# EAGLE design Pure Keys aec-pcb1 (EAGLE 8.6.0)

## Sheet 1 of 7: ATMEGA328P
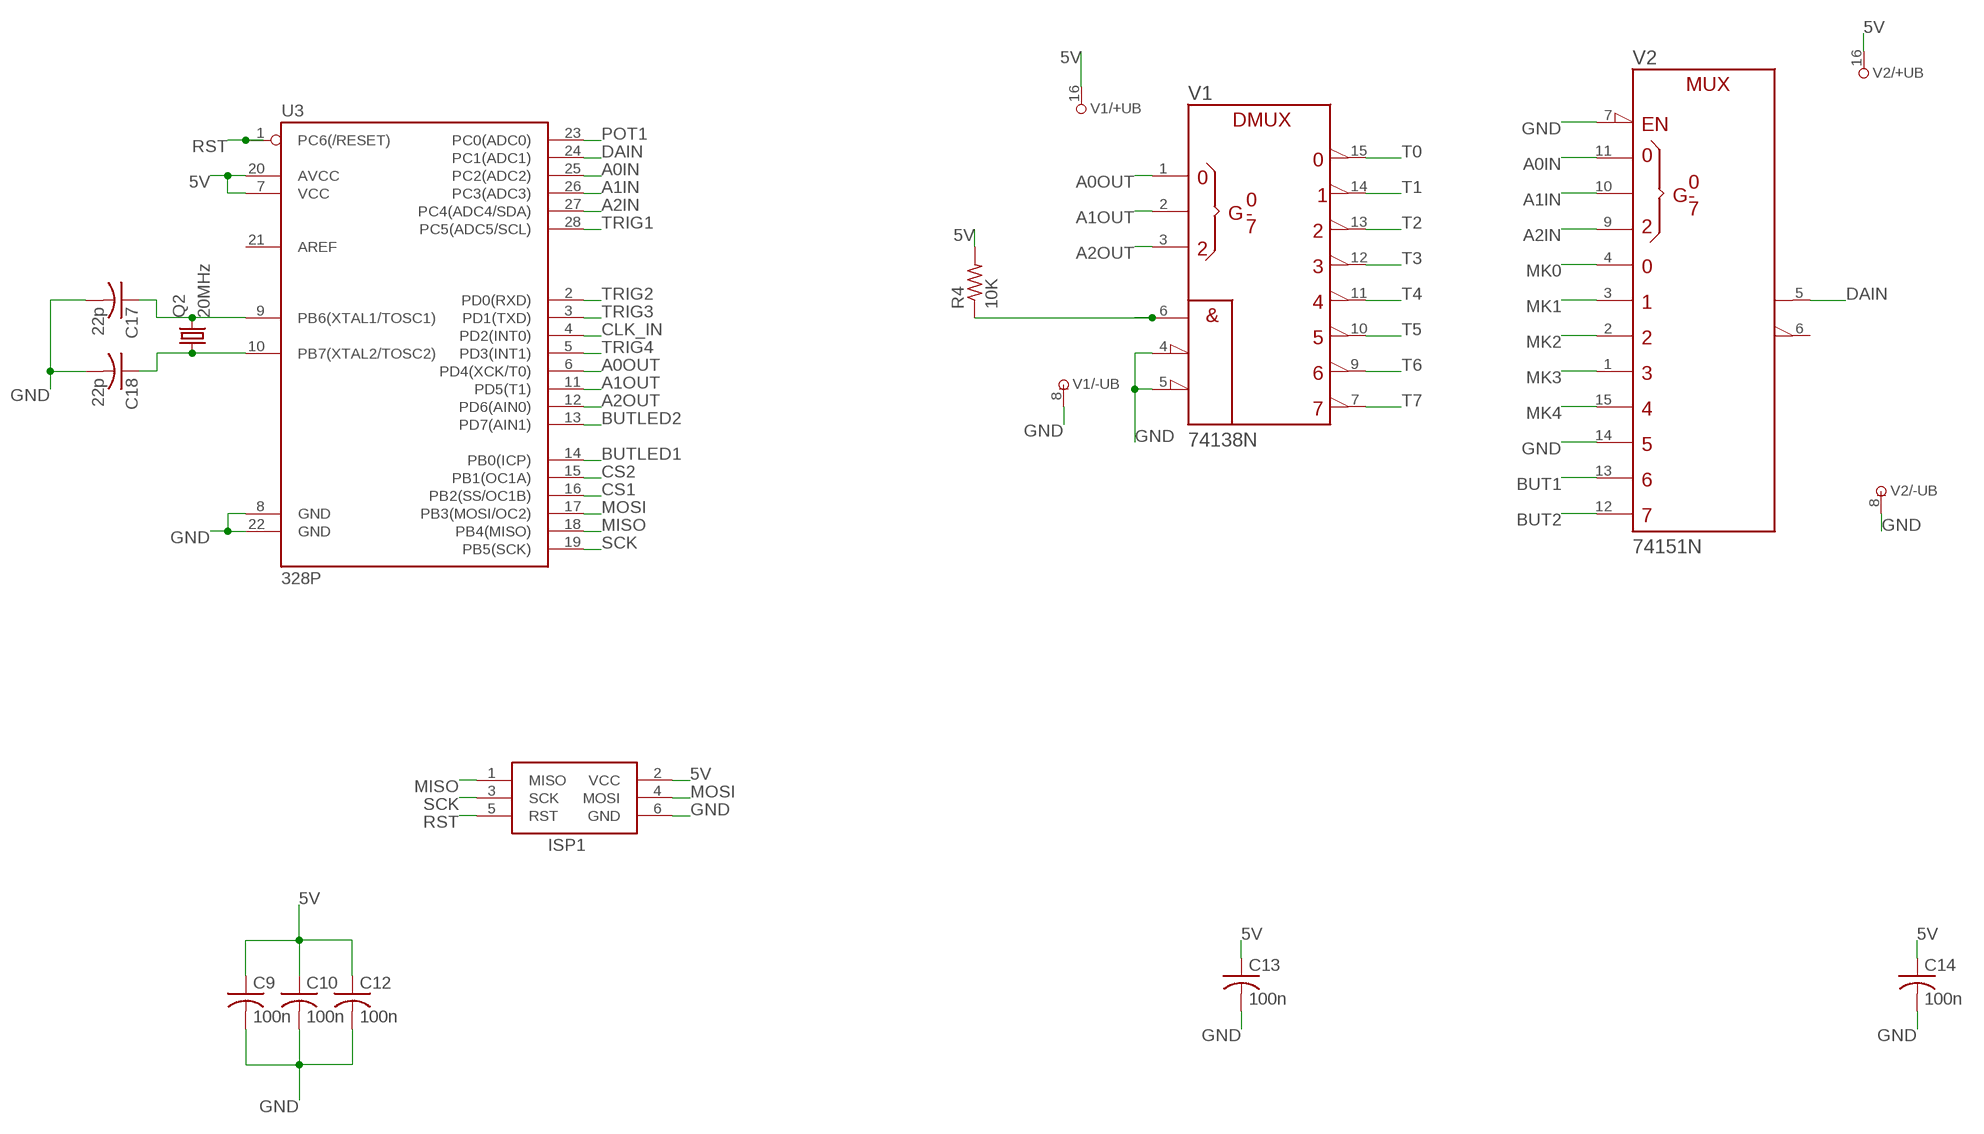
[diagram p0: schematic, sheet 1]

### Parts
C9  100n  C-USC0805K  [C0805K]
C10  100n  C-USC0805K  [C0805K]
C12  100n  C-USC0805K  [C0805K]
C13  100n  C-USC0805K  [C0805K]
C14  100n  C-USC0805K  [C0805K]
C17  22p  C-USC0805K  [C0805K]
C18  22p  C-USC0805K  [C0805K]
ISP1  AVRISP-6  [AVRISP]
Q2  20MHz  CRYSTALHC49UP  [HC49UP]
R4  10K  R-US_R0805  [R0805]
U3  328P  ATMEGA328P_PDIP  [DIP28]
V1  74138N  [DIL16]
V2  74151N  [DIL16]

### Nets
5V: C9.1 C10.1 C12.1 C13.1 C14.1 ISP1.2(VCC) R4.2 U3.7(VCC) U3.20(AVCC) V1.16(+UB) V2.16(+UB) ; also sheet 2,4,5,6,7
A0IN: U3.25(PC2(ADC2)) V2.11(A)
A0OUT: U3.6(PD4(XCK/T0)) V1.1(A)
A1IN: U3.26(PC3(ADC3)) V2.10(B)
A1OUT: U3.11(PD5(T1)) V1.2(B)
A2IN: U3.27(PC4(ADC4/SDA)) V2.9(C)
A2OUT: U3.12(PD6(AIN0)) V1.3(C)
BUT1: V2.13(D6) ; also sheet 6
BUT2: V2.12(D7) ; also sheet 6
BUTLED1: U3.14(PB0(ICP)) ; also sheet 6
BUTLED2: U3.13(PD7(AIN1)) ; also sheet 6
CLK_IN: U3.4(PD2(INT0)) ; also sheet 7
CS1: U3.16(PB2(SS/OC1B)) ; also sheet 5
CS2: U3.15(PB1(OC1A)) ; also sheet 5
DAIN: U3.24(PC1(ADC1)) V2.5(Y)
ENOUT: R4.1 V1.6(G1)
GND: C9.2 C10.2 C12.2 C13.2 C14.2 C17.2 C18.2 ISP1.6(GND) U3.8(GND) U3.22(GND) V1.4(!G2A) V1.5(!G2B) V1.8(-UB) V2.7(!G) V2.8(-UB) V2.14(D5) ; also sheet 2,3,4,5,6,7
MISO: ISP1.1(MISO) U3.18(PB4(MISO))
MK0: V2.4(D0) ; also sheet 3
MK1: V2.3(D1) ; also sheet 3
MK2: V2.2(D2) ; also sheet 3
MK3: V2.1(D3) ; also sheet 3
MK4: V2.15(D4) ; also sheet 3
MOSI: ISP1.4(MOSI) U3.17(PB3(MOSI/OC2)) ; also sheet 5
N$10: C17.1 Q2.2 U3.9(PB6(XTAL1/TOSC1))
N$11: C18.1 Q2.1 U3.10(PB7(XTAL2/TOSC2))
POT1: U3.23(PC0(ADC0)) ; also sheet 6
RST: ISP1.5(RST) U3.1(PC6(/RESET))
SCK: ISP1.3(SCK) U3.19(PB5(SCK)) ; also sheet 5
T0: V1.15(Y0) ; also sheet 3
T1: V1.14(Y1) ; also sheet 3
T2: V1.13(Y2) ; also sheet 3
T3: V1.12(Y3) ; also sheet 3
T4: V1.11(Y4) ; also sheet 3
T5: V1.10(Y5) ; also sheet 3
T6: V1.9(Y6) ; also sheet 3
T7: V1.7(Y7) ; also sheet 3
TRIG1: U3.28(PC5(ADC5/SCL)) ; also sheet 4
TRIG2: U3.2(PD0(RXD)) ; also sheet 4
TRIG3: U3.3(PD1(TXD)) ; also sheet 4
TRIG4: U3.5(PD3(INT1)) ; also sheet 4
Unconnected: U3.21(AREF) V2.6(W)

## Sheet 2 of 7: Power
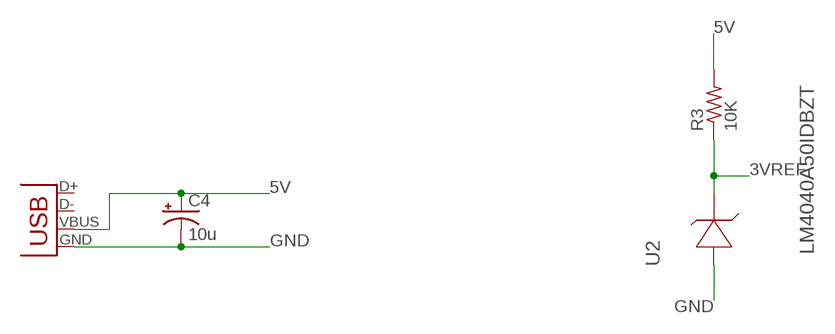
[diagram p1: schematic, sheet 2]

### Parts
C4  10u  CPOL-US153CLV-0505  [153CLV-0505]
JP2  USB-B  USBPTH  [USB-B-PTH]
R3  10K  R-US_R0805  [R0805]
U2  LM4040A50IDBZT  [SOT95P237X112-3N]

### Nets
3VREF: R3.1 U2.1(CATHODE) ; also sheet 5
5V: C4.+ JP2.VBUS R3.2 ; also sheet 1,4,5,6,7
GND: C4.- JP2.GND U2.2(ANODE) ; also sheet 1,3,4,5,6,7
Unconnected: JP2.D+ JP2.D- U2.3(NC)

## Sheet 3 of 7: Keyboard Connector
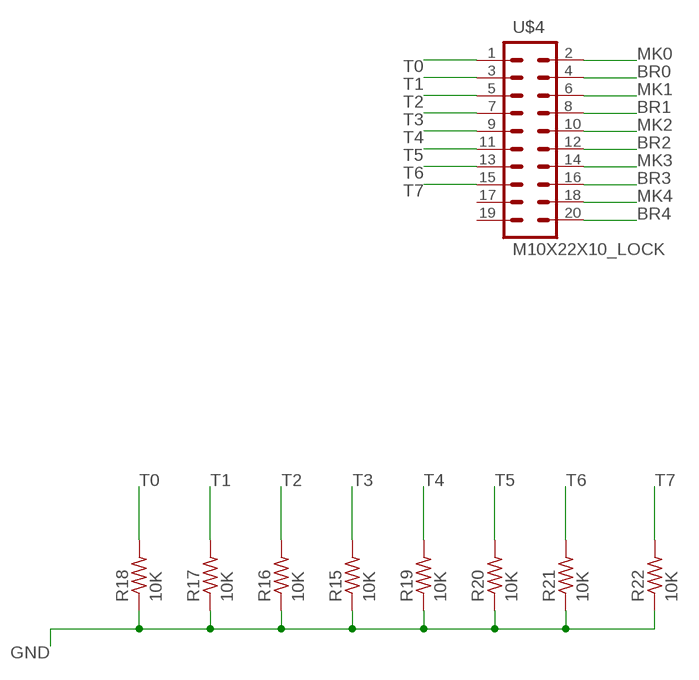
[diagram p2: schematic, sheet 3]

### Parts
R15  10K  R-US_R0805  [R0805]
R16  10K  R-US_R0805  [R0805]
R17  10K  R-US_R0805  [R0805]
R18  10K  R-US_R0805  [R0805]
R19  10K  R-US_R0805  [R0805]
R20  10K  R-US_R0805  [R0805]
R21  10K  R-US_R0805  [R0805]
R22  10K  R-US_R0805  [R0805]
U$4  M10X22X10_LOCK  [2X10_LOCK]

### Nets
BR0: U$4.4
BR1: U$4.8
BR2: U$4.12
BR3: U$4.16
BR4: U$4.20
GND: R15.1 R16.1 R17.1 R18.1 R19.1 R20.1 R21.1 R22.1 ; also sheet 1,2,4,5,6,7
MK0: U$4.2 ; also sheet 1
MK1: U$4.6 ; also sheet 1
MK2: U$4.10 ; also sheet 1
MK3: U$4.14 ; also sheet 1
MK4: U$4.18 ; also sheet 1
T0: R18.2 U$4.1 ; also sheet 1
T1: R17.2 U$4.3 ; also sheet 1
T2: R16.2 U$4.5 ; also sheet 1
T3: R15.2 U$4.7 ; also sheet 1
T4: R19.2 U$4.9 ; also sheet 1
T5: R20.2 U$4.11 ; also sheet 1
T6: R21.2 U$4.13 ; also sheet 1
T7: R22.2 U$4.15 ; also sheet 1
Unconnected: U$4.17 U$4.19

## Sheet 4 of 7: Triggers
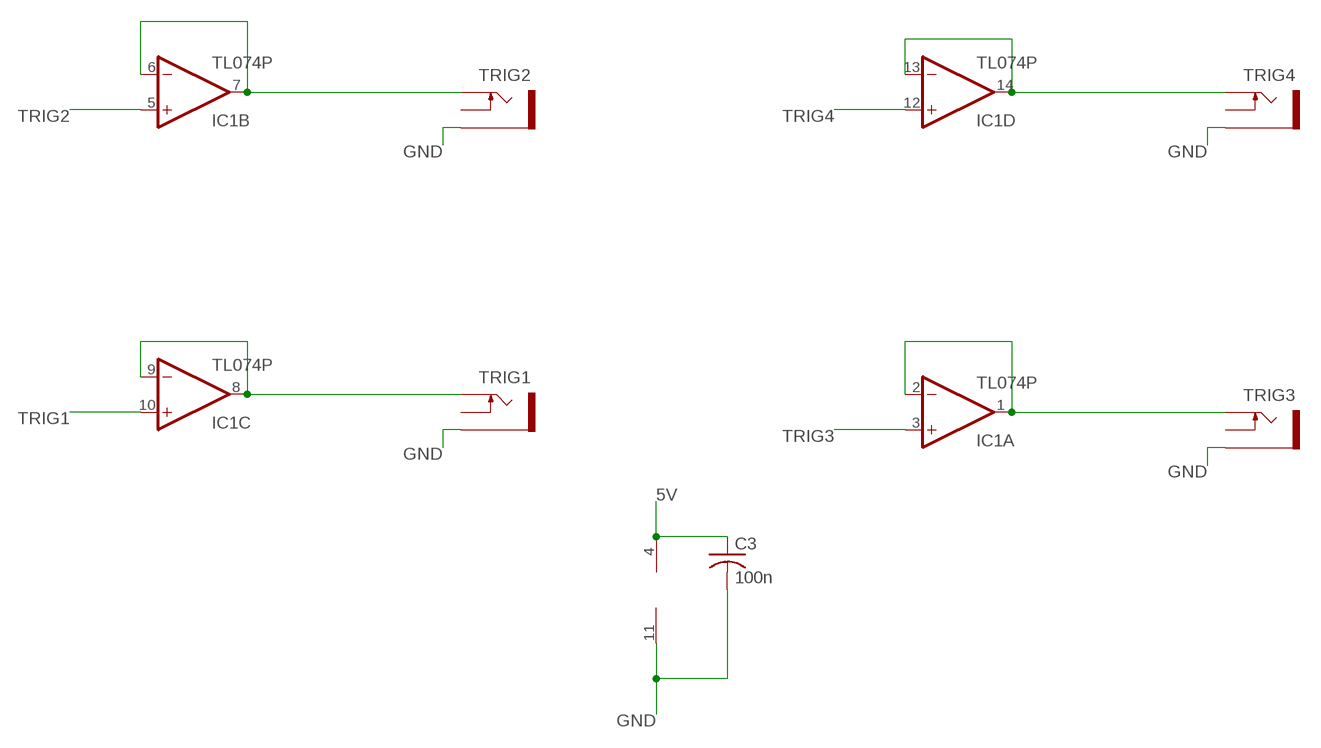
[diagram p3: schematic, sheet 4]

### Parts
C3  100n  C-USC0805K  [C0805K]
IC1  TL074P  [DIL14]
TRIG1  PJ302M  [PJ302M]
TRIG2  PJ302M  [PJ302M]
TRIG3  PJ302M  [PJ302M]
TRIG4  PJ302M  [PJ302M]

### Nets
5V: C3.1 IC1.4(P:V+) ; also sheet 1,2,5,6,7
GND: C3.2 IC1.11(P:V-) TRIG1.GND(SLEEVE) TRIG2.GND(SLEEVE) TRIG3.GND(SLEEVE) TRIG4.GND(SLEEVE) ; also sheet 1,2,3,5,6,7
N$3: IC1.6(B:-IN) IC1.7(B:OUT) TRIG2.TIP
N$4: IC1.8(C:OUT) IC1.9(C:-IN) TRIG1.TIP
N$5: IC1.13(D:-IN) IC1.14(D:OUT) TRIG4.TIP
N$6: IC1.1(A:OUT) IC1.2(A:-IN) TRIG3.TIP
TRIG1: IC1.10(C:+IN) ; also sheet 1
TRIG2: IC1.5(B:+IN) ; also sheet 1
TRIG3: IC1.3(A:+IN) ; also sheet 1
TRIG4: IC1.12(D:+IN) ; also sheet 1
Unconnected: TRIG1.SW(SWITCH) TRIG2.SW(SWITCH) TRIG3.SW(SWITCH) TRIG4.SW(SWITCH)

## Sheet 5 of 7: CV Out
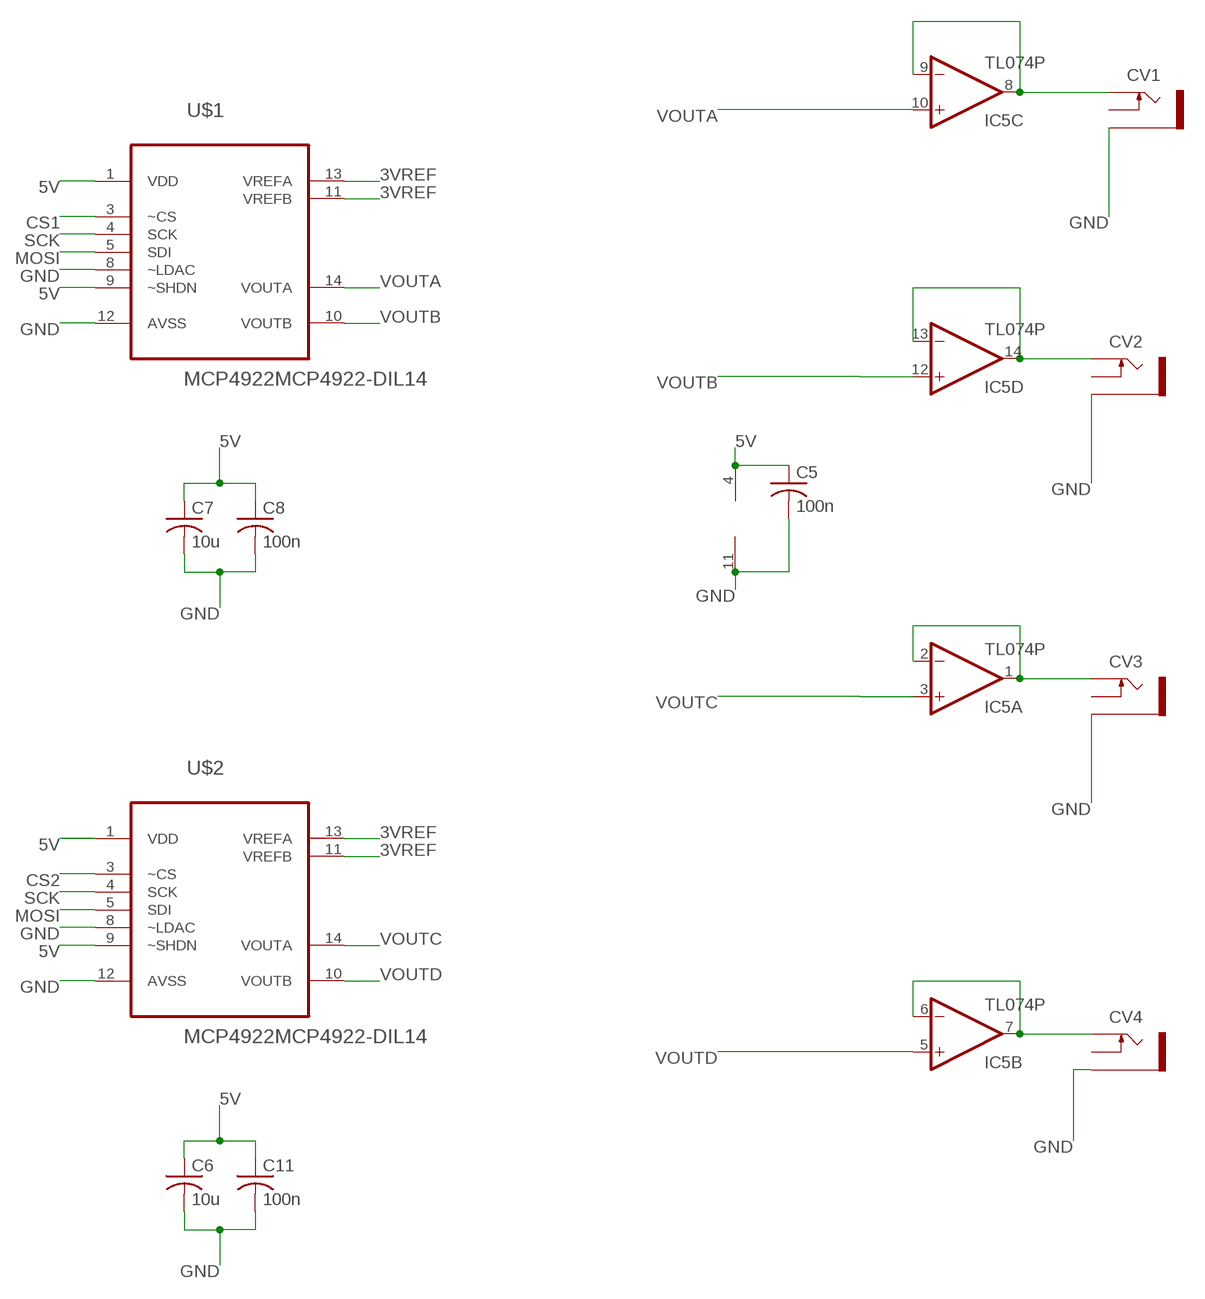
[diagram p4: schematic, sheet 5]

### Parts
C5  100n  C-USC0805K  [C0805K]
C6  10u  C-USC0805K  [C0805K]
C7  10u  C-USC0805K  [C0805K]
C8  100n  C-USC0805K  [C0805K]
C11  100n  C-USC0805K  [C0805K]
CV1  PJ302M  [PJ302M]
CV2  PJ302M  [PJ302M]
CV3  PJ302M  [PJ302M]
CV4  PJ302M  [PJ302M]
IC5  TL074P  [DIL14]
U$1  MCP4922MCP4922-DIL14  [DIL14]
U$2  MCP4922MCP4922-DIL14  [DIL14]

### Nets
3VREF: U$1.11(VREFB) U$1.13(VREFA) U$2.11(VREFB) U$2.13(VREFA) ; also sheet 2
5V: C5.1 C6.1 C7.1 C8.1 C11.1 IC5.4(P:V+) U$1.1(VDD) U$1.9(~SHDN) U$2.1(VDD) U$2.9(~SHDN) ; also sheet 1,2,4,6,7
CS1: U$1.3(~CS) ; also sheet 1
CS2: U$2.3(~CS) ; also sheet 1
GND: C5.2 C6.2 C7.2 C8.2 C11.2 CV1.GND(SLEEVE) CV2.GND(SLEEVE) CV3.GND(SLEEVE) CV4.GND(SLEEVE) IC5.11(P:V-) U$1.8(~LDAC) U$1.12(AVSS) U$2.8(~LDAC) U$2.12(AVSS) ; also sheet 1,2,3,4,6,7
MOSI: U$1.5(SDI) U$2.5(SDI) ; also sheet 1
N$7: CV1.TIP IC5.8(C:OUT) IC5.9(C:-IN)
N$25: CV4.TIP IC5.6(B:-IN) IC5.7(B:OUT)
N$31: CV3.TIP IC5.1(A:OUT) IC5.2(A:-IN)
N$36: CV2.TIP IC5.13(D:-IN) IC5.14(D:OUT)
SCK: U$1.4(SCK) U$2.4(SCK) ; also sheet 1
VOUTA: IC5.10(C:+IN) U$1.14(VOUTA)
VOUTB: IC5.12(D:+IN) U$1.10(VOUTB)
VOUTC: IC5.3(A:+IN) U$2.14(VOUTA)
VOUTD: IC5.5(B:+IN) U$2.10(VOUTB)
Unconnected: CV1.SW(SWITCH) CV2.SW(SWITCH) CV3.SW(SWITCH) CV4.SW(SWITCH)

## Sheet 6 of 7: Pots and Buttons
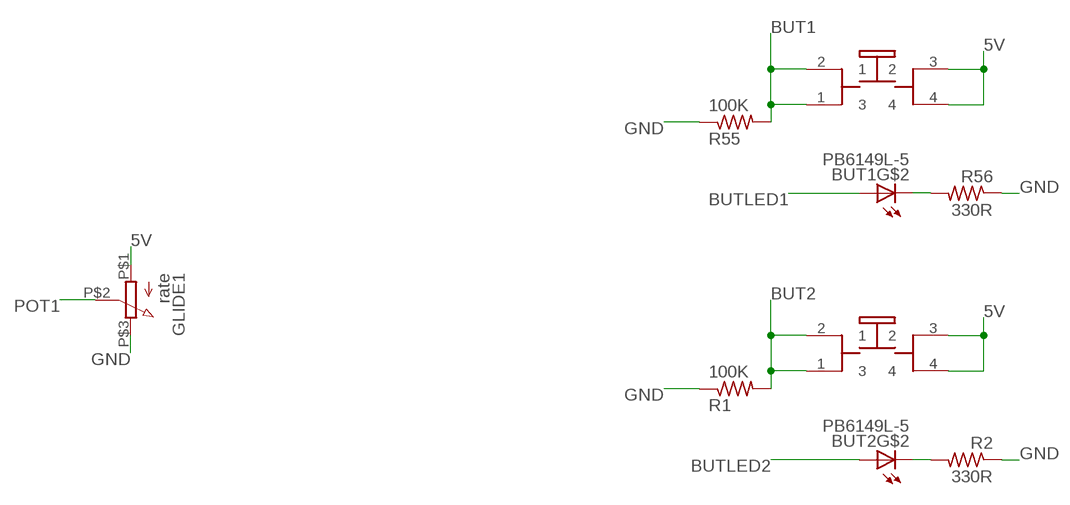
[diagram p5: schematic, sheet 6]

### Parts
BUT1  PB6149L-5  [PB6149L]
BUT2  PB6149L-5  [PB6149L]
GLIDE1  rate  9MMPOT  [POT]
R1  100K  R-US_R0805  [R0805]
R2  330R  R-US_R0805  [R0805]
R55  100K  R-US_R0805  [R0805]
R56  330R  R-US_R0805  [R0805]

### Nets
5V: BUT1.3 BUT1.4 BUT2.3 BUT2.4 GLIDE1.P$1 ; also sheet 1,2,4,5,7
BUT1: BUT1.1 BUT1.2 R55.2 ; also sheet 1
BUT2: BUT2.1 BUT2.2 R1.2 ; also sheet 1
BUTLED1: BUT1.A ; also sheet 1
BUTLED2: BUT2.A ; also sheet 1
GND: GLIDE1.P$3 R1.1 R2.1 R55.1 R56.1 ; also sheet 1,2,3,4,5,7
N$8: BUT2.K(C) R2.2
N$65: BUT1.K(C) R56.2
POT1: GLIDE1.P$2 ; also sheet 1

## Sheet 7 of 7: Clock
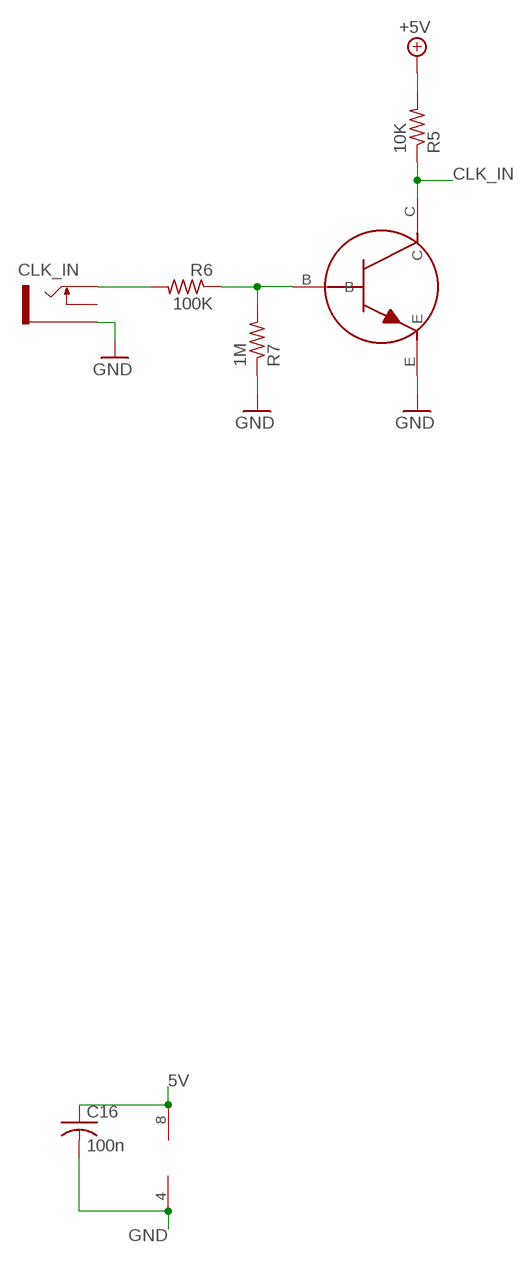
[diagram p6: schematic, sheet 7]

### Parts
C16  100n  C-USC0805K  [C0805K]
CLK_IN  PJ302M  [PJ302M]
IC2  TL072P  [DIL08]
R5  10K  R-US_R0805  [R0805]
R6  100K  R-US_R0805  [R0805]
R7  1M  R-US_R0805  [R0805]
T1  2N3904  TRANSISTOR_MMBT3904  [TRANSISTOR_SINGLE_N-TYPE]

### Nets
5V: C16.1 IC2.8(P:V+) R5.2 ; supply symbol labelled +5V ; also sheet 1,2,4,5,6
CLK_IN: R5.1 T1.C ; also sheet 1
GND: C16.2 CLK_IN.GND(SLEEVE) IC2.4(P:V-) R7.1 T1.E ; also sheet 1,2,3,4,5,6
N$17: R6.1 R7.2 T1.B
N$26: CLK_IN.TIP R6.2
Unconnected: CLK_IN.SW(SWITCH) IC2.1(A:OUT) IC2.2(A:-IN) IC2.3(A:+IN) IC2.5(B:+IN) IC2.6(B:-IN) IC2.7(B:OUT)

## Library data of the parts
BUT1 BUT2 = INSTRUO:PB6149L-5
C3 C5-C14 C16-C18 = rcl:C-US: CAPACITOR, American symbol
C4 = rcl:CPOL-US: POLARIZED CAPACITOR, American symbol
CLK_IN CV1-CV4 TRIG1-TRIG4 = GMSN:PJ302M: PJ302M horizontal / right angled mount 3.5 mm jack socket
GLIDE1 = GMSN:9MMPOT
IC1 IC5 = GMSN:TL074: OP AMP
IC2 = GMSN:TL072: OP AMP
ISP1 = adafruit:AVRISP: AVR ISP HEADER Standard 6 pin header for AVR programming
JP2 = SparkFun-Connectors:USB: USB Connectors USB-B-PTH is fully proven SKU : PRT-00139/CONN-08278 USB-miniB is fully proven SKU : PRT-00587 USB-A-PCB is untested. USB-A-H is throughly reviewed, but untested. Spark Fun Electronics SKU : PRT-00437 USB-B-SMT is throughly reviewed, but untested. Needs silkscreen touching up. USB-A-S has not been used/tested USB-MB-H has not been used/tested USB-MICROB has been used. CONN-09505; PROD_ID: CONN-08278
Q2 = adafruit:CRYSTAL: CRYSTAL; OC_FARNELL: unknown; OC_NEWARK: unknown
R1-R7 R15-R22 R55 R56 = rcl:R-US_: RESISTOR, American symbol
T1 = INSTRUO:TRANSISTOR_MMBT3904
U2 = GMSN:LM4040A50IDBZT: PRECISION MICROPOWER SHUNT VOLTAGE REFERENCE; MPN: LM4040A50IDBZT; OC_FARNELL: 1755108; OC_NEWARK: 58K5870; PACKAGE: 3-SOT-23; SUPPLIER: TEXAS INSTRUMENTS
U3 = SparkFun-IC-Microcontroller:ATMEGA328P_PDIP: Atmel 328P Through hole ATMEGA328P uC used in the Arduino 32kb flash, 1k EEPROM, 2k SRAM Datasheet <http://www.sparkfun.com/datasheets/Components/SMD/ATMega328.pdf> SparkFun Products Storefront component: AVR 28 Pin 20MHz 32K 6A/D - ATMega328P <https://www.sparkfun.com/products/9061> (COM-09061) SparkFun Simon Says - Through-Hole Soldering Kit <https://www.sparkfun.com/products/10547> (KIT-10547) SparkFun Learn to Solder - Simon Says <https://www.sparkfun.com/products/13708> (KIT-13708) SparkFun BigTime Watch Kit <https://www.sparkfun.com/products/11734> (KIT-11734) SparkFun ClockIt <https://www.sparkfun.com/products/10930> (KIT-10930) SparkFun Serial Enabled LCD Kit <https://www.sparkfun.com/products/10097> (LCD-10097) SparkFun Simon Tilts - Through Hole Soldering Kit <https://www.sparkfun.com/products/12634> (KIT-12634) SparkFun Frequency Counter Kit <https://www.sparkfun.com/products/10140> (KIT-10140) FabFM Radio Kit <https://www.sparkfun.com/products/11043> (KIT-11043) SparkFun Binary Blaster Kit <https://www.sparkfun.com/products/12037> (KIT-12037) SparkFun Metro-Gnome <https://www.sparkfun.com/products/9236> (KIT-09236) ATmega328 with Arduino Optiboot (Uno) <https://www.sparkfun.com/products/10524> (DEV-10524); PROD_ID: IC-09136
U$1 U$2 = GMSN-R2Project:MCP4922
U$4 = SparkFun-Connectors:M10X2: This was SPECIALLY designed to be used with our Graphic LCD Backpack. Be sure you want to use this! It is not only staggered on each line of header holes, but IT IS ALSO offset of the center point of the top and bottom lines by 5 mil. This causes the headers to lock into place on the "standard" footprint on the LCD screen. The extra squares on the tdocu layer are there simply to reference other pins (if you were to actually populate a longer header than ten long - this is what we do with the backpacks).
V1 = 74ttl-din:74*138: 3-line to 8-line DECODER/DEMULTIPLEXER
V2 = 74ttl-din:74*151: Data SELECTOR/MULTIPLEXER

## Board
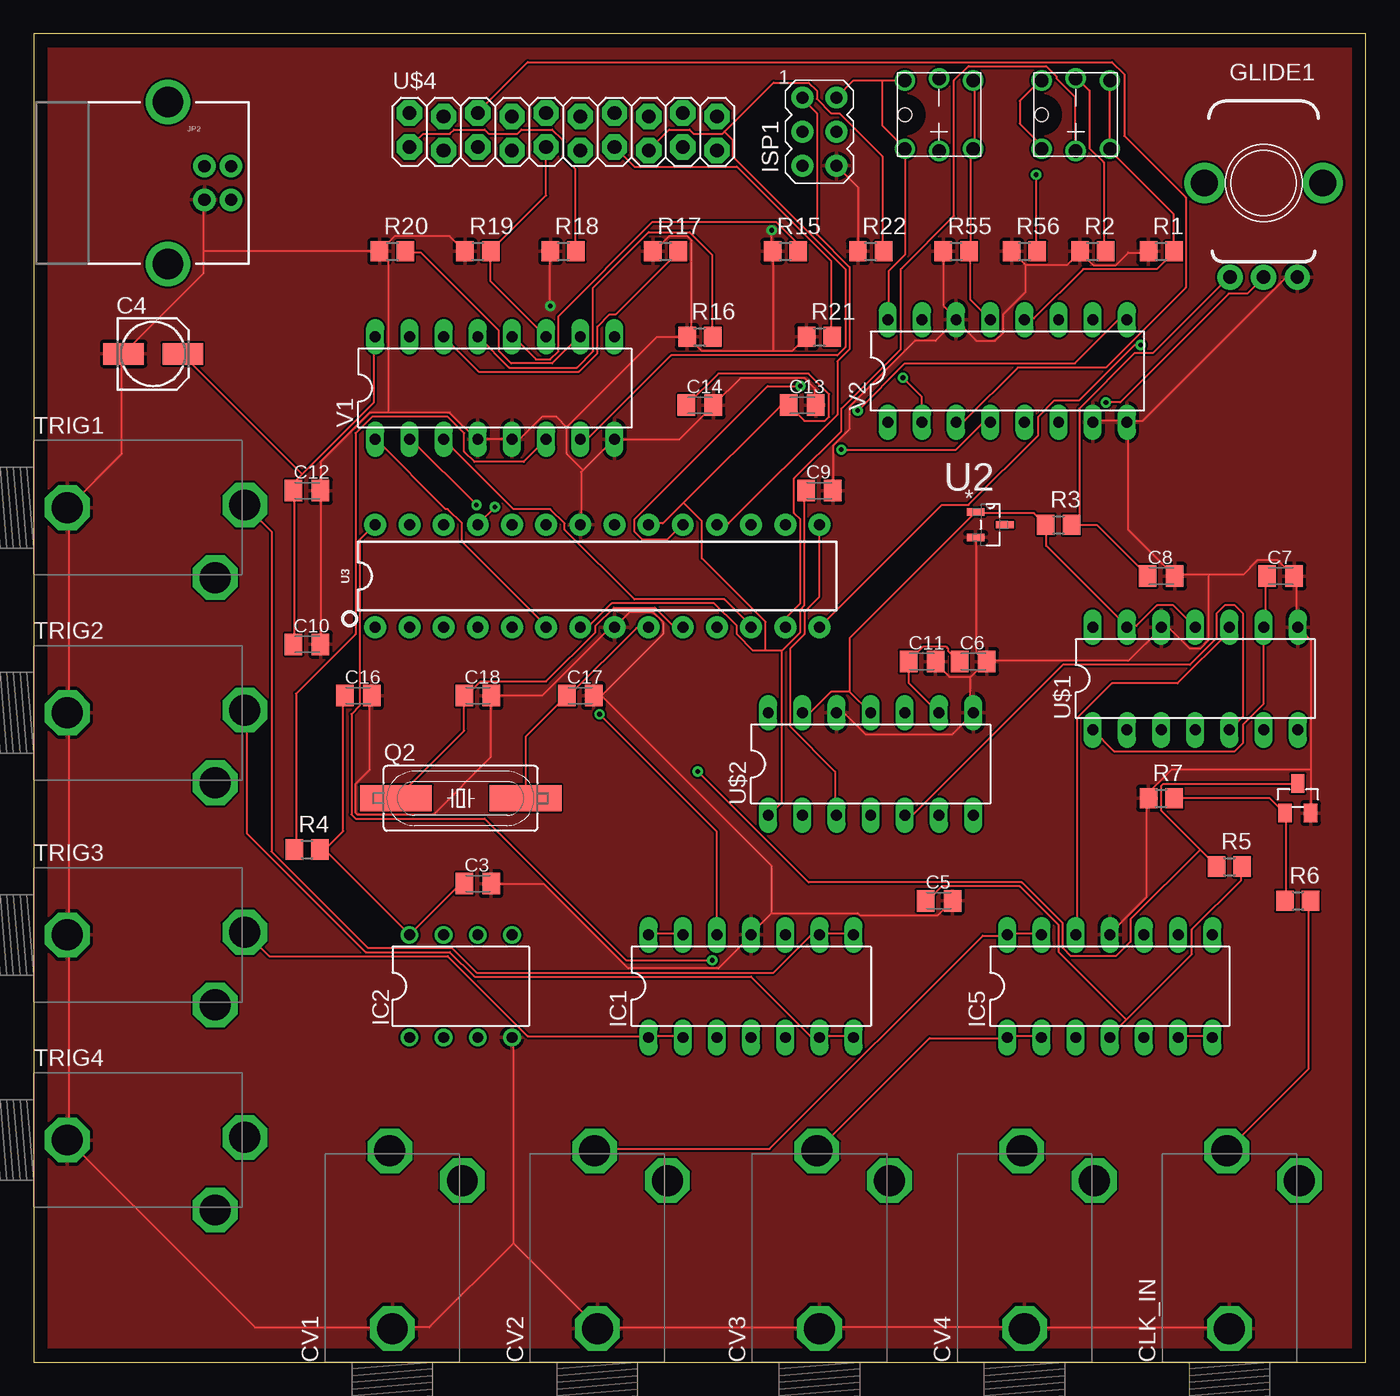
[diagram p7: board, top side]
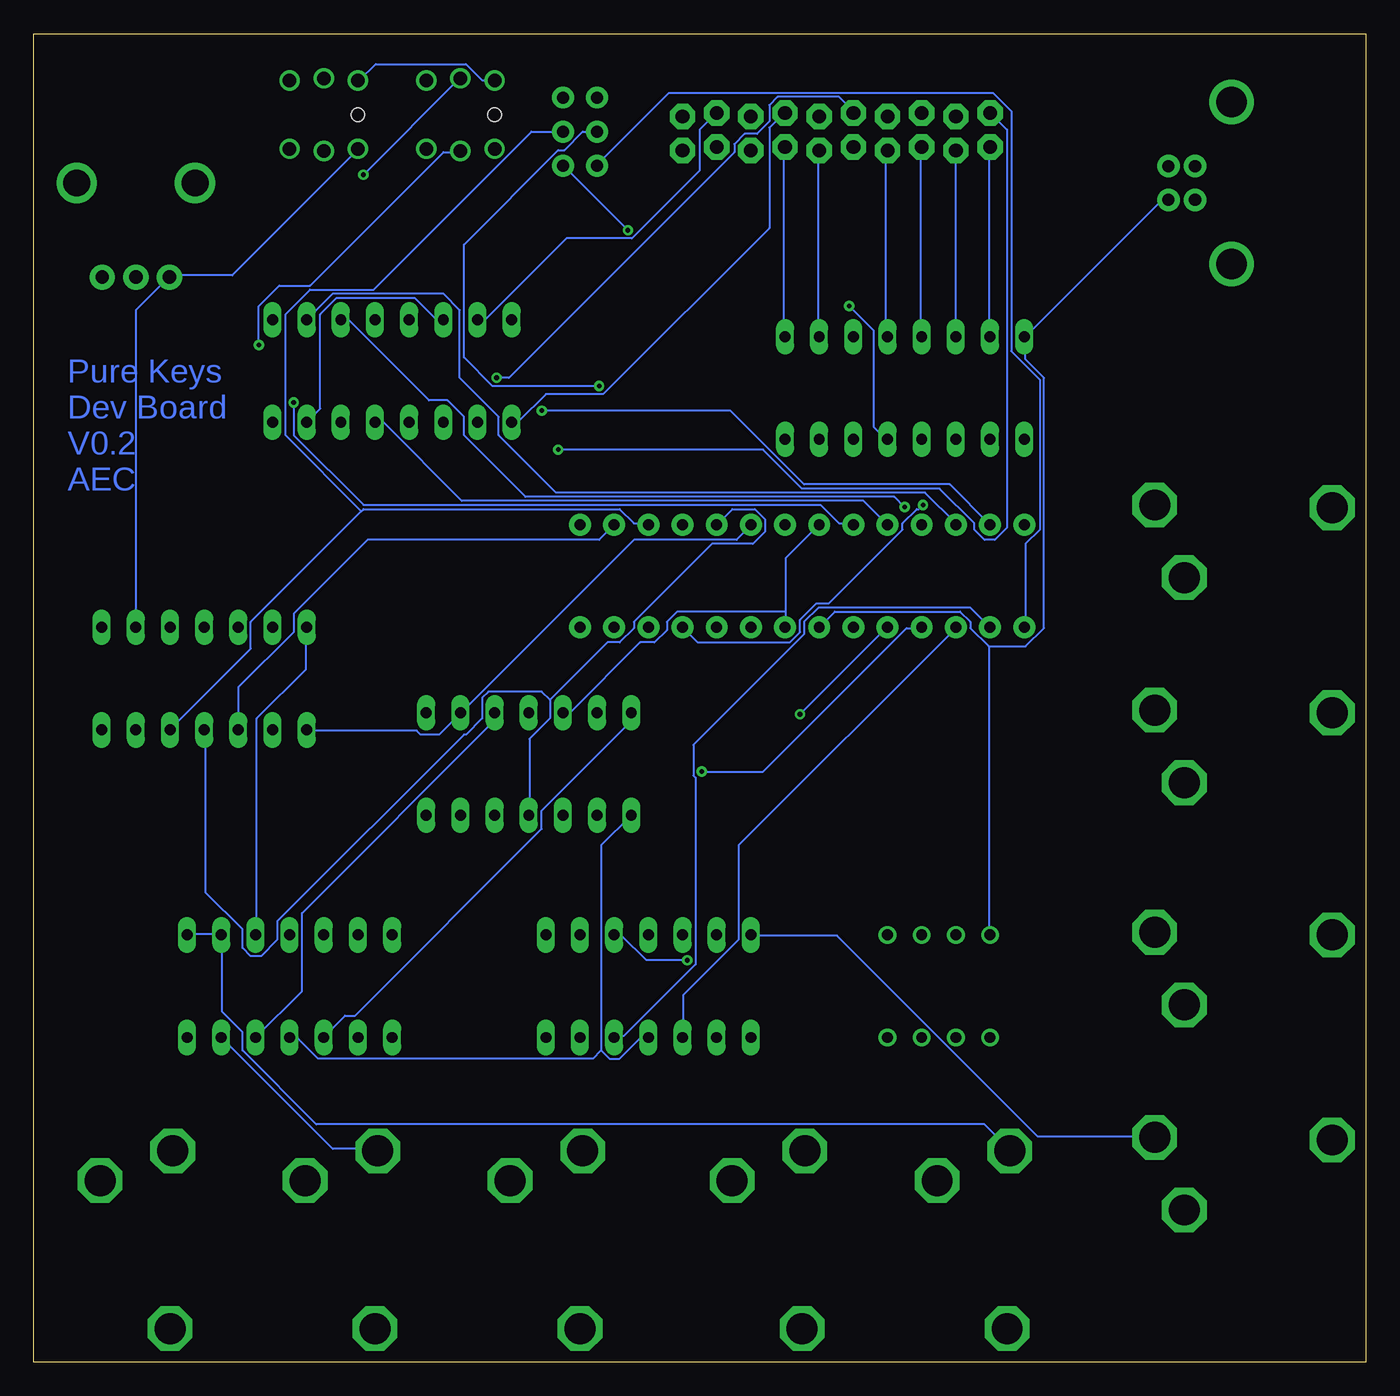
[diagram p8: board, bottom side, seen from below]

Size 99.04 x 98.73 mm. Coordinates in mm from the lower left corner, seen from the top.
Outline: 0,0 99.04,0 99.04,98.73 0,98.73 0,0
Copper layers (1*16): Top 0.035mm / dielectric 1.5mm / Bottom 0.035mm
Design rules "default": minimum track width 6mil, minimum drill 0.35mm, track to track 6mil, track to pad 6mil, pad to pad 6mil, via to via 6mil, smd to smd 6mil, copper to edge 40mil, drill to drill 6mil, minimum pad ring 10mil, minimum via ring 8mil, stop-mask expansion 4mil, vias tented up to drill 0mil, thermal gap 10mil

### Footprints (pad centres in the part's own frame; a part is rotated, then mirrored left to right if it is on the bottom)
PB6149L = drill 1: 1 2.54,-2.54; 2 2.54,2.54; 3 -2.54,-2.54; 4 -2.54,2.54; A 0,-2.7; K 0,2.7 | hole 1: -2.54,0
C0805K = smd 1.3 x 1.6: 1 -1,0; 2 1,0
153CLV-0505 = smd 3 x 1.6: + 2.2,0; - -2.2,0
PJ302M = drill 2.3 pad 3.3 octagon: GND 2.5,0; SW 13.5,-5.2; TIP 15.7,0.2
POT = drill 1 pad 1.88: P$1 -2.5,-7; P$2 0,-7; P$3 2.5,-7 | drill 2 pad 2.68: P$4 -4.4,0; P$5 4.4,0
DIL14 = drill 0.813 long: 1 -7.62,-3.81; 2 -5.08,-3.81; 3 -2.54,-3.81; 4 0,-3.81; 5 2.54,-3.81; 6 5.08,-3.81; 7 7.62,-3.81; 8 7.62,3.81; 9 5.08,3.81; 10 2.54,3.81; 11 0,3.81; 12 -2.54,3.81; 13 -5.08,3.81; 14 -7.62,3.81
DIL08 = drill 0.813 pad 1.27: 1 -3.81,-3.81; 2 -1.27,-3.81; 3 1.27,-3.81; 4 3.81,-3.81; 5 3.81,3.81; 6 1.27,3.81; 7 -1.27,3.81; 8 -3.81,3.81
AVRISP = drill 0.9 pad 1.626: 1 -1.27,2.54; 2 1.27,2.54; 3 -1.27,0; 4 1.27,0; 5 -1.27,-2.54; 6 1.27,-2.54
USB-B-PTH = drill 0.914 pad 1.676: D+ 0,1.25; D- 1.981,1.25; GND 0,-1.25; VBUS 1.981,-1.25 | drill 2.286: S1 -2.718,-6.02; S2 -2.718,6.02
HC49UP = smd 5.334 x 1.93: 1 -4.826,0; 2 4.826,0
R0805 = smd 1.3 x 1.5: 1 -0.95,0; 2 0.95,0
TRANSISTOR_SINGLE_N-TYPE = smd 1 x 1.4: B -0.95,-1.1; C 0,1.1; E 0.95,-1.1
SOT95P237X112-3N = smd 1.321 x 0.559: 1 -1.092,0.94; 2 -1.092,-0.94 | smd 1.321 x 0.508: 3 1.092,0
DIP28 = drill 0.813 pad 1.626: 1 -16.51,-3.81; 2 -13.97,-3.81; 3 -11.43,-3.81; 4 -8.89,-3.81; 5 -6.35,-3.81; 6 -3.81,-3.81; 7 -1.27,-3.81; 8 1.27,-3.81; 9 3.81,-3.81; 10 6.35,-3.81; 11 8.89,-3.81; 12 11.43,-3.81; 13 13.97,-3.81; 14 16.51,-3.81; 15 16.51,3.81; 16 13.97,3.81; 17 11.43,3.81; 18 8.89,3.81; 19 6.35,3.81; 20 3.81,3.81; 21 1.27,3.81; 22 -1.27,3.81; 23 -3.81,3.81; 24 -6.35,3.81; 25 -8.89,3.81; 26 -11.43,3.81; 27 -13.97,3.81; 28 -16.51,3.81
2X10_LOCK = drill 1.016 pad 1.88 octagon: 1 -11.43,-1.143; 2 -11.43,1.397; 3 -8.89,-1.397; 4 -8.89,1.143; 5 -6.35,-1.143; 6 -6.35,1.397; 7 -3.81,-1.397; 8 -3.81,1.143; 9 -1.27,-1.143; 10 -1.27,1.397; 11 1.27,-1.397; 12 1.27,1.143; 13 3.81,-1.143; 14 3.81,1.397; 15 6.35,-1.397; 16 6.35,1.143; 17 8.89,-1.143; 18 8.89,1.397; 19 11.43,-1.397; 20 11.43,1.143
DIL16 = drill 0.813 long: 1 -8.89,-3.81; 2 -6.35,-3.81; 3 -3.81,-3.81; 4 -1.27,-3.81; 5 1.27,-3.81; 6 3.81,-3.81; 7 6.35,-3.81; 8 8.89,-3.81; 9 8.89,3.81; 10 6.35,3.81; 11 3.81,3.81; 12 1.27,3.81; 13 -1.27,3.81; 14 -3.81,3.81; 15 -6.35,3.81; 16 -8.89,3.81

### Placement (x,y rotation side)
BUT1  67.31,92.71 0 top
BUT2  77.47,92.71 0 top
C3  33.02,35.56 0 top
C4  8.89,74.93 0 top
C5  67.31,34.29 0 top
C6  69.85,52.07 0 top
C7  92.71,58.42 0 top
C8  83.82,58.42 0 top
C9  58.42,64.77 0 top
C10  20.32,53.34 0 top
C11  66.04,52.07 0 top
C12  20.32,64.77 0 top
C13  57.15,71.12 0 top
C14  49.53,71.12 0 top
C16  24.13,49.53 0 top
C17  40.64,49.53 0 top
C18  33.02,49.53 0 top
CLK_IN  88.9,0 90 top
CV1  26.67,0 90 top
CV2  41.91,0 90 top
CV3  58.42,0 90 top
CV4  73.66,0 90 top
GLIDE1  91.44,87.63 0 top
IC1  53.34,27.94 0 top
IC2  31.75,27.94 0 top
IC5  80.01,27.94 0 top
ISP1  58.42,91.44 0 top
JP2  12.7,87.63 0 top
Q2  31.75,41.91 0 top
R1  83.82,82.55 0 top
R2  78.74,82.55 0 top
R3  76.2,62.23 0 top
R4  20.32,38.1 0 top
R5  88.9,36.83 0 top
R6  93.98,34.29 0 top
R7  83.82,41.91 0 top
R15  55.88,82.55 0 top
R16  49.53,76.2 0 top
R17  46.99,82.55 0 top
R18  39.37,82.55 0 top
R19  33.02,82.55 0 top
R20  26.67,82.55 0 top
R21  58.42,76.2 0 top
R22  62.23,82.55 0 top
R55  68.58,82.55 0 top
R56  73.66,82.55 0 top
T1  93.98,41.91 0 top
TRIG1  0,63.5 0 top
TRIG2  0,48.26 0 top
TRIG3  0,31.75 0 top
TRIG4  0,16.51 0 top
U2  71.12,62.23 0 top
U3  41.91,58.42 0 top
U$1  86.36,50.8 0 top
U$2  62.23,44.45 0 top
U$4  39.37,91.44 0 top
V1  34.29,72.39 0 top
V2  72.39,73.66 0 top

### Tracks (layer width: path | path; a pad name or v marks a point on that pad's centre or on a via)
3VREF
  Top 0.152: 60.66,49.84 59.28,49.84 57.76,48.31 57.15,48.31 U$2.13 | U$2.11 60.66,49.84 | U$1.11 84.73,56.24 83.52,56.24 81.99,54.71 81.38,54.71 U$1.13 81.23,54.71 75.29,60.66 75.29,62.18 R3.1 75.13,62.33 74.37,63.09 70.1,63.09 U2.1 60.66,53.8 60.66,49.84
5V
  Top 0.152: C7.1 91.59,58.37 91.59,54.86 91.44,54.71 U$1.9 91.44,48.92 89.92,47.4 89.92,46.02 89.31,45.41 80.31,45.41 U$1.1 | U$2.9 67.21,48.31 65.08,50.44 65.08,51.97 C11.1 65.08,52.12 66.14,53.19 67.82,53.19 67.97,53.03 67.97,52.88 68.73,52.12 C6.1 | 63.09,95.25 60.96,95.25 ISP1.2 | 63.09,95.25 BUT1.4 | V2.16 63.55,77.57 63.55,81.08 64.77,82.3 BUT1.3 64.77,90.22 63.09,91.9 63.09,95.25 | 77.72,62.18 79.1,62.18 82.75,58.52 C8.1 | 77.72,62.18 77.27,62.18 R3.2 77.72,62.18 | BUT2.3 74.83,90.22 74.83,90.53 73.3,92.05 73.3,93.73 74.83,95.25 BUT2.4 | 77.72,62.18 77.72,70.87 81.84,74.98 83.21,74.98 88.85,80.62 GLIDE1.P$1 | 19.36,64.77 19.36,53.34 C10.1 | 19.96,65.99 19.36,65.38 19.36,64.77 | 19.96,65.99 25.3,71.32 25.3,76.2 V1.16 | 19.36,64.77 C12.1 | 19.96,65.99 11.12,74.83 C4.+ | 81.23,25.45 80.01,24.23 IC5.4 | 81.23,25.45 86.11,30.33 86.11,32.16 89.76,35.81 89.76,36.73 R5.2 | 81.23,25.45 76.2,30.48 76.2,32.46 73.3,35.36 67.51,35.36 66.45,34.29 C5.1 | 21.64,38.1 R4.2 21.34,38.1 | 21.64,38.1 27.89,31.85 IC2.8 31.7,35.51 32,35.51 C3.1 | 21.64,38.1 23.01,39.47 23.01,49.53 C16.1 | C14.1 48.62,71.17 50.9,73.46 57.61,73.46 59.13,71.93 59.13,70.26 58.83,69.95 57.3,69.95 56.24,71.02 C13.1 56.08,71.02 55.47,71.02 48.31,63.86 | 48.31,63.86 46.79,62.33 45.72,62.33 U3.20 | 55.63,52.88 57,54.25 57,55.93 57.3,56.24 57.3,64.77 C9.1 | 55.63,52.88 55.63,41.6 54.71,40.69 U$2.1 | 55.63,52.88 54.41,52.88 | 54.41,52.88 53.49,52.88 52.27,54.1 52.27,54.71 50.6,56.39 42.98,56.39 41.3,54.71 40.69,54.71 U3.7 | 48.31,63.86 49.68,62.48 49.68,59.74 54.41,55.02 54.41,52.88
  Bottom 0.152: U$1.1 78.64,46.94 70.56,46.94 70.26,46.63 68.89,46.63 67.36,48.16 U$2.9 67.21,48.31 54.41,61.11 46.79,61.11 45.72,62.18 U3.20 | BUT2.3 74.98,90.07 84.28,80.77 88.85,80.77 GLIDE1.P$1 89,80.62 91.44,78.18 U$1.9 | BUT1.4 65.68,95.25 66.9,96.47 73.61,96.47 74.83,95.25 BUT2.4 | 25.3,76.2 15.24,86.26 14.78,86.26 JP2.VBUS | 56.84,23.16 56.24,22.55 55.47,22.55 53.95,24.08 53.34,24.08 IC1.4 | 56.84,23.16 56.84,38.41 U$2.1 | 28.04,53.19 28.04,31.85 IC2.8 | 28.04,53.19 29.41,54.56 29.41,55.02 30.18,55.78 39.47,55.78 U3.7 | 56.84,23.16 57.45,22.55 77.88,22.55 79.4,24.08 80.01,24.08 IC5.4 | 25.3,76.2 25.3,74.52 23.93,73.15 23.93,54.56 25.3,53.19 28.04,53.19 | 25.3,76.2 V1.16
A0IN  (via drill 0.35)
  Top 0.152: v34.29,63.55 33.07,62.33 U3.25
  Bottom 0.152: v34.29,63.55 35.05,64.31 62.48,64.31 67.06,68.89 67.06,70.26 68.28,71.48 69.65,71.48 75.59,77.42 76.2,77.42 V2.11
A0OUT
  Top 0.152: V1.1 25.45,68.58 30.63,63.4 30.79,63.4 31.85,62.33 31.85,60.96 38.1,54.71 U3.6
A1IN
  Bottom 0.152: V2.10 76.81,79.4 68.58,79.4 67.36,78.18 67.36,73.15 64.47,70.26 64.47,68.89 60.2,64.62 32.77,64.62 30.48,62.33 U3.26
A1OUT  (via drill 0.35)
  Top 0.152: v32.92,63.7 28.04,68.58 V1.2
  Bottom 0.152: v32.92,63.7 33.22,63.4 33.38,63.4 34.44,62.33 34.44,61.87 39.93,56.39 40.84,56.39 42.06,55.17 42.06,54.25 42.82,53.49 49.68,53.49 U3.11
A2IN  (via drill 0.35)
  Top 0.152: v61.27,70.71 64.77,74.22 77.42,74.22 80.62,77.42 81.23,77.42 V2.9
  Bottom 0.152: v61.27,70.71 47.24,70.71 41.76,65.23 30.94,65.23 U3.27
A2OUT
  Top 0.152: V1.3 35.66,63.4 38.41,63.4 39.47,62.33 39.47,61.87 44.65,56.69 51.36,56.69 53.34,54.71 U3.12
BUT1
  Top 0.152: V2.13 69.65,78.94 69.65,82.45 R55.2 69.65,82.6 69.65,89.92 69.8,90.07 BUT1.1 69.95,90.22 69.95,95.25 BUT1.2
BUT2
  Top 0.152: V2.12 73.76,77.57 74.37,77.57 78.03,81.23 83.52,81.23 84.73,82.45 R1.2 84.73,82.6 84.73,85.34 80.01,90.07 BUT2.1 BUT2.2
BUTLED1  (via drill 0.35)
  Top 0.152: v82.3,75.59 81.84,75.59 77.72,71.48 75.89,71.48 74.68,70.26 74.68,68.89 69.49,63.7 67.51,63.7 U3.14
  Bottom 0.152: v82.3,75.59 82.3,78.49 80.77,80.01 78.49,80.01 68.58,89.92 67.36,89.92 BUT1.A
BUTLED2
  Top 0.152: BUT2.A 77.42,90.07 77.42,94.03 76.05,95.4 76.05,95.56 75.29,96.32 69.49,96.32 68.43,95.25 68.43,85.19 64.47,81.23 64.47,75.29 60.05,70.87 60.05,69.19 56.54,65.68 56.54,63.09 57,62.64 57,56.39 55.93,55.32 55.93,54.71 U3.13
CLK_IN  (via drill 0.35)
  Top 0.152: 86.72,38.1 87.94,36.88 R5.1 | 86.72,38.1 83.82,41 83.82,42.82 83.97,42.98 93.88,42.98 T1.C | v49.38,43.89 57.61,35.66 73.46,35.66 76.5,32.61 76.5,30.79 77.11,30.18 80.47,30.18 81.53,31.24 81.53,32.92 86.72,38.1
  Bottom 0.152: v49.38,43.89 44.81,43.89 34.14,54.56 33.07,54.56 U3.4
CS1
  Bottom 0.152: U$1.3 83.82,50.14 79.7,54.25 79.7,55.63 74.22,61.11 57,61.11 U3.16
CS2
  Top 0.152: U$2.3 59.59,40.69 59.59,43.89 56.24,47.24 56.24,53.03 57.3,54.1 57.3,55.78 58.37,56.84 58.37,62.18 U3.15
DAIN
  Bottom 0.152: U3.24 37.34,64.01 67.21,64.01 73,69.8 73.61,69.8 V2.5
ENOUT
  Top 0.152: V1.6 36.42,66.9 32.77,66.9 32,67.67 32,69.04 30.79,70.26 25.15,70.26 23.93,69.04 23.93,54.1 19.51,49.68 19.51,38.1 R4.1
GND  (via drill 0.35)
  Top 0.152: 73.76,81.53 72.85,82.45 R56.1 | 73.76,81.53 76.81,81.53 77.72,82.45 R2.1 77.88,82.45 78.79,81.53 80.47,81.53 81.38,82.45 82.75,82.45 R1.1 | R55.1 67.67,82.45 67.67,78.49 68.58,77.57 V2.14 68.58,77.42 | 68.58,77.42 67.06,75.89 65.53,75.89 60.66,71.02 60.66,69.34 59.44,68.12 59.44,64.77 C9.2 | 73.76,81.53 73.76,79.55 72.08,77.88 72.08,76.5 71.48,75.89 70.1,75.89 68.58,77.42 | IC5.11 80.01,31.85 82.75,34.59 82.75,41.91 R7.1 82.91,41.91 82.91,42.37 84.58,44.04 94.94,44.04 | 94.94,44.04 94.94,53.65 U$1.8 93.88,54.71 93.88,58.22 93.73,58.37 C7.2 93.57,58.52 92.51,59.59 90.98,59.59 89.92,58.52 87.33,58.52 | 94.94,44.04 94.94,40.84 T1.E | U2.2 70.1,61.27 70.1,52.73 70.71,52.12 C6.2 | 69.65,50.9 68.12,50.9 67.06,51.97 C11.2 | 69.65,50.9 70.71,51.97 C6.2 | U$2.12 59.74,48.16 60.35,48.16 61.87,46.63 68.28,46.63 69.8,48.16 U$2.8 69.65,48.46 69.65,50.9 | V2.7 78.79,69.95 81.23,69.95 V2.8 | 87.33,58.52 84.89,58.52 C8.2 84.73,58.52 81.38,61.87 81.38,69.8 V2.8 | 83.82,54.56 84.43,54.56 85.95,53.03 86.72,53.03 87.33,53.65 87.33,58.52 | GLIDE1.P$3 93.88,80.62 93.12,80.62 82.45,69.95 81.38,69.95 V2.8 | 83.82,54.56 81.38,52.12 70.87,52.12 C6.2 | 83.82,54.56 U$1.12 | 21.34,64.77 21.34,53.34 C10.2 | v38.41,78.49 38.41,82.45 R18.1 | 21.34,64.77 21.34,66.9 24.99,70.56 26.36,70.56 | 26.36,70.56 30.94,70.56 32.92,68.58 V1.4 V1.5 36.12,68.58 37.8,70.26 38.86,70.26 39.62,69.49 | 21.34,64.77 C12.2 | C3.2 34.14,35.51 37.95,35.51 44.2,29.26 50.9,29.26 53.34,31.7 IC1.11 53.34,31.85 54.86,33.38 | 54.86,33.38 61.27,33.38 61.42,33.22 67.21,33.22 68.28,34.29 C5.2 | ISP1.6 61.27,87.33 61.27,82.6 R22.1
  Top 0.152: 48.62,76.2 49.68,75.13 55.02,75.13 | 55.02,75.13 56.39,75.13 57.45,76.2 R21.1 | 48.62,76.2 48.92,76.5 48.92,83.36 48.62,83.67 47.24,83.67 46.18,82.6 R17.1 | 48.62,76.2 R16.1 46.33,76.2 39.62,69.49 | 55.02,75.13 55.02,82.45 R15.1 54.86,82.6 v54.86,84.12 | C16.2 24.99,49.53 24.99,44.04 23.93,42.98 23.93,40.84 24.08,40.69 29.72,40.69 33.98,44.96 33.98,49.53 C18.2 37.8,49.53 42.82,54.56 43.13,54.56 U3.8 44.35,55.78 46.02,55.78 46.79,55.02 46.79,54.1 42.22,49.53 | 42.22,49.53 C17.2 41.76,49.53 | C13.2 58.06,71.17 58.06,72.39 57.3,73.15 52.58,73.15 50.6,71.17 C14.2 50.44,71.02 48.01,68.58 V1.8 43.13,68.58 40.84,66.29 | 40.84,66.29 40.69,66.14 40.69,62.33 U3.22 | 39.62,69.49 39.62,67.51 40.84,66.29 | 54.86,33.38 54.86,36.88 42.22,49.53 | CLK_IN.GND 88.85,2.59 73.76,2.59 CV4.GND 73.61,2.59 58.52,2.59 CV3.GND 58.37,2.59 41.91,2.59 | 35.66,8.84 35.66,24.08 IC2.4 | 41.91,2.59 35.66,8.84 | 26.67,2.59 29.41,2.59 35.66,8.84 | 41.91,2.59 CV2.GND | R20.1 25.76,82.6 26.82,83.67 30.94,83.67 32,82.6 R19.1 | 12.65,82.6 12.65,80.92 6.71,74.98 C4.- 6.55,74.83 6.55,67.51 2.59,63.55 TRIG1.GND 2.59,63.4 2.59,48.31 TRIG2.GND 2.59,48.16 2.59,31.85 TRIG3.GND 2.59,31.7 2.59,16.61 TRIG4.GND 2.59,16.46 16.46,2.59 26.67,2.59 | 12.65,82.6 12.65,86.26 JP2.GND | 12.65,82.6 25.6,82.6 R20.1 | 26.67,2.59 CV1.GND | 26.36,70.56 26.36,81.84 25.76,82.45 R20.1
  Bottom 0.152: V2.7 77.72,70.87 77.72,77.88 76.5,79.1 70.71,79.1 69.19,77.57 68.58,77.57 V2.14 | v38.41,78.49 36.58,76.66 36.58,69.49 35.66,68.58 V1.5 | v54.86,84.12 59.59,88.85 ISP1.6 | 43.13,55.78 43.13,59.74 U3.22 | 43.13,55.78 43.13,54.71 U3.8 | 43.13,55.78 51.21,55.78 51.97,55.02 51.97,54.41 52.88,53.49 53.95,53.49 59.13,48.31 59.59,48.31 U$2.12
  pour Top: 0,99.06 99.06,99.06 99.06,0 0,0 0,97.79
MISO
  Top 0.152: U3.18 50.9,62.33 51.66,62.33 59.74,70.41 59.74,74.37 60.66,75.29 60.66,81.38 58.22,83.82 58.22,92.81 57.15,93.88 ISP1.1
MK0  (via drill 0.35)
  Top 0.152: v60.05,67.82 68.58,67.82 70.56,69.8 71.02,69.8 V2.4
  Bottom 0.152: v60.05,67.82 44.81,67.82 41.91,64.92 31.7,64.92 29.11,62.33 29.11,61.87 28.35,61.11 27.58,61.11 26.67,62.03 26.67,91.59 27.89,92.81 U$4.2
MK1
  Top 0.152: V2.3 68.58,69.95 69.19,69.95 73.15,73.91 79.7,73.91 85.65,79.86 85.65,86.56 81.08,91.14 81.08,95.71 80.16,96.62 36.73,96.62 33.07,92.96 U$4.6
MK2  (via drill 0.35)
  Top 0.152: v64.62,73.15 65.99,71.78 65.99,69.95 V2.2
  Bottom 0.152: v64.62,73.15 63.7,73.15 46.94,89.92 46.94,90.53 46.18,91.29 45.26,91.29 44.35,92.2 44.35,93.42 43.74,94.03 39.17,94.03 38.1,92.96 U$4.10
MK3
  Bottom 0.152: V2.1 63.4,69.95 62.94,69.95 60.96,71.93 56.69,71.93 44.35,84.28 44.35,91.75 43.28,92.81 U$4.14
MK4
  Bottom 0.152: V2.15 65.99,77.57 65.38,77.57 59.44,83.52 54.56,83.52 49.53,88.54 49.53,91.59 48.31,92.81 U$4.18
MOSI
  Top 0.152: U$1.5 89.92,48.01 89.92,55.63 89.31,56.24 88.54,56.24 87.94,55.63 87.94,53.8 85.95,51.82 76.5,51.82 65.38,40.69 64.77,40.69 U$2.5
  Bottom 0.152: 74.68,63.25 82.91,55.02 82.91,53.03 88.85,47.09 U$1.5 | 74.68,63.25 74.52,63.4 55.47,63.4 54.41,62.33 53.34,62.33 U3.17 | ISP1.4 62.03,91.44 73.76,79.7 78.49,79.7 80.31,77.88 80.31,68.89 74.68,63.25
N$3
  Top 0.152: IC1.7 60.96,24.23 58.52,24.23 IC1.6 58.37,24.23 57.76,24.23 53.34,28.65 32.77,28.65 30.94,30.48 24.69,30.48 15.85,39.32 15.85,48.31 TRIG2.TIP
N$4
  Top 0.152: IC1.8 60.96,31.85 58.52,31.85 IC1.9 58.37,31.7 57.76,31.7 55.02,28.96 32.92,28.96 31.09,30.79 24.84,30.79 17.68,37.95 17.68,61.72 15.85,63.55 TRIG1.TIP
N$5
  Top 0.152: IC1.14 45.72,31.85 48.16,31.85 IC1.13
  Bottom 0.152: IC1.14 45.72,31.7 39.32,31.7 24.38,16.76 15.85,16.76 TRIG4.TIP
N$6
  Top 0.152: 45.72,24.23 48.16,24.23 IC1.2 | 45.72,24.23 36.73,24.23 30.79,30.18 17.53,30.18 15.85,31.85 TRIG3.TIP | 45.72,24.23 IC1.1
N$7
  Bottom 0.152: IC5.8 87.63,31.85 85.19,31.85 IC5.9 85.04,31.7 85.04,26.06 83.52,24.54 83.52,23.16 78.03,17.68 28.35,17.68 26.52,15.85 CV1.TIP
N$8
  Top 0.152: R2.2 79.55,82.6 79.55,89.15 78.49,90.22 78.49,94.49 77.57,95.4 BUT2.K
N$10
  Top 0.152: U3.9 45.72,54.56 44.81,54.56 39.78,49.53 C17.1 39.62,49.53 36.58,46.48 Q2.2
N$11
  Top 0.152: Q2.1 26.98,41.91 32,46.94 32,49.53 C18.1 32.16,49.53 33.22,50.6 38.1,50.6 41.76,54.25 41.76,54.71 43.13,56.08 46.18,56.08 47.55,54.71 48.16,54.71 U3.10
N$17
  Top 0.152: R6.1 93.12,34.29 93.12,40.69 T1.B 92.96,40.84 91.9,41.91 R7.2
N$25
  Top 0.152: IC5.6 85.19,24.23 87.63,24.23 IC5.7
  Bottom 0.152: IC5.6 76.81,15.85 73.61,15.85 CV4.TIP
N$26
  Top 0.152: R6.2 94.79,34.29 94.79,21.79 88.85,15.85 CLK_IN.TIP
N$31
  Top 0.152: IC5.2 74.83,24.23 72.39,24.23 IC5.1 72.39,24.08 66.6,24.08 58.37,15.85 CV3.TIP
N$36
  Top 0.152: IC5.13 74.83,31.85 72.39,31.85 IC5.14 72.39,31.7 70.56,31.7 54.71,15.85 41.76,15.85 CV2.TIP
N$65  (via drill 0.35)
  Top 0.152: v74.52,88.24 74.52,82.6 R56.2
  Bottom 0.152: v74.52,88.24 67.36,95.4 BUT1.K
POT1  (via drill 0.35)
  Top 0.152: v79.7,71.32 80.77,71.32 88.85,79.4 90.22,79.4 GLIDE1.P$2
  Bottom 0.152: v79.7,71.32 79.7,68.89 74.52,63.7 40.54,63.7 39.17,62.33 38.1,62.33 U3.23
RST
  Bottom 0.152: U3.1 25.3,54.71 25.3,60.81 24.23,61.87 24.23,73 26.36,75.13 26.36,92.96 27.74,94.34 51.82,94.34 57.15,89 ISP1.5
SCK  (via drill 0.35)
  Top 0.152: v57,72.54 54.56,72.54 44.65,62.64 44.65,61.72 45.26,61.11 47.09,61.11 48.16,62.18 U3.19
  Bottom 0.152: 60.66,49.23 60.66,47.85 62.18,46.33 62.18,40.69 U$2.4 | 60.66,49.23 56.39,53.49 55.47,53.49 54.41,54.56 54.41,55.02 48.62,60.81 45.57,60.81 44.65,61.72 44.65,62.64 45.41,63.4 47.09,63.4 U3.19 | 60.66,49.23 61.27,49.84 65.23,49.84 65.68,49.38 65.68,47.85 66.9,46.63 67.06,46.63 80.92,32.77 80.92,31.39 82.14,30.18 82.91,30.18 83.52,30.79 83.52,32.16 86.26,34.9 86.26,46.94 U$1.4 | ISP1.3 58.22,91.44 59.59,90.07 60.05,90.07 67.06,83.06 67.06,74.68 64.92,72.54 v57,72.54
T0
  Top 0.152: R18.2 40.23,82.6 40.23,88.7 39.32,89.61 39.32,90.83 38.56,91.59 36.27,91.59 35.97,91.29 33.83,91.29 33.53,91.59 31.24,91.59 30.94,91.29 28.96,91.29 28.04,90.37 U$4.1
  Bottom 0.152: V1.15 28.04,76.2 28.04,90.22 U$4.1
T1
  Top 0.152: V1.14 33.07,73.61 40.54,73.61 41.91,74.98 41.91,76.96 42.82,77.88 43.28,77.88 47.85,82.45 R17.2
  Bottom 0.152: V1.14 U$4.3
T2
  Top 0.152: R16.2 50.44,76.2 50.44,82.3 48.77,83.97 45.72,83.97 41.6,79.86 41.6,75.13 40.39,73.91 35.36,73.91 33.07,76.2 V1.13
  Bottom 0.152: U$4.5 33.07,90.22 33.07,76.2 V1.13
T3
  Top 0.152: R15.2 56.69,82.6 56.69,83.21 55.17,84.73 46.02,84.73 39.01,77.72 39.01,75.13 38.41,74.52 37.34,74.52 35.66,76.2 V1.12
  Bottom 0.152: U$4.7 35.66,89.92 35.66,76.2 V1.12
T4
  Top 0.152: V1.11 33.98,80.31 33.98,82.45 R19.2 33.98,82.6 38.1,86.72 U$4.9
T5
  Top 0.152: R20.2 27.74,82.45 28.8,82.45 34.59,76.66 34.59,75.13 35.51,74.22 38.56,74.22 40.54,76.2 V1.10
  Bottom 0.152: U$4.11 40.69,89.92 40.69,76.2 V1.10
T6
  Top 0.152: R21.2 59.28,76.2 59.28,81.84 52.27,88.85 44.65,88.85 43.28,90.22 U$4.13
  Bottom 0.152: V1.9 43.28,76.2 43.28,90.22 U$4.13
T7
  Top 0.152: 51.36,91.44 51.21,91.29 49.07,91.29 48.77,91.59 47.24,91.59 45.72,90.07 U$4.15 | 51.36,91.44 55.02,95.1 57.61,95.1 58.22,94.49 58.22,93.88 59.28,92.81 59.89,92.81 63.09,89.61 63.09,82.6 R22.2 | V1.7 41.15,68.58 47.4,74.83 59.74,74.83 60.35,75.44 60.35,81.23 51.97,89.61 51.97,90.83 51.36,91.44
TRIG1  (via drill 0.35)
  Top 0.152: v50.44,29.87 44.04,29.87 33.53,40.39 23.93,40.39 23.62,40.69 23.62,48.16 24.23,48.77 24.23,61.11 25.3,62.18 U3.28
  Bottom 0.152: v50.44,29.87 53.49,29.87 55.32,31.7 55.78,31.7 IC1.10
TRIG2
  Bottom 0.152: U3.2 29.41,56.08 40.69,56.08 41.76,55.02 41.76,54.1 49.99,45.87 49.99,43.59 49.84,43.43 49.84,29.57 55.17,24.23 55.78,24.23 IC1.5
TRIG3
  Bottom 0.152: IC1.3 50.75,24.23 50.75,27.28 46.63,31.39 46.63,38.41 30.48,54.56 U3.3
TRIG4  (via drill 0.35)
  Top 0.152: v42.06,48.16 50.75,39.47 50.75,31.85 IC1.12
  Bottom 0.152: v42.06,48.16 35.66,54.56 U3.5
VOUTA
  Bottom 0.152: U$1.14 78.79,54.56 78.79,51.51 82.45,47.85 82.45,31.85 IC5.10
VOUTB
  Top 0.152: IC5.12 77.57,31.85 77.57,47.85 80.16,50.44 85.04,50.44 88.85,54.25 88.85,54.56 U$1.10
VOUTC
  Bottom 0.152: U$2.14 54.71,48.16 54.71,47.55 61.27,41 61.27,39.62 75.13,25.76 75.89,25.76 77.42,24.23 IC5.3
VOUTD
  Bottom 0.152: U$2.10 64.77,47.7 79.1,33.38 79.1,27.58 IC5.5

### Text on the board
Bottom: Pure Keys / Dev Board / V0.2 / AEC